# Altium schematic sheet protect.SchDoc
size A4
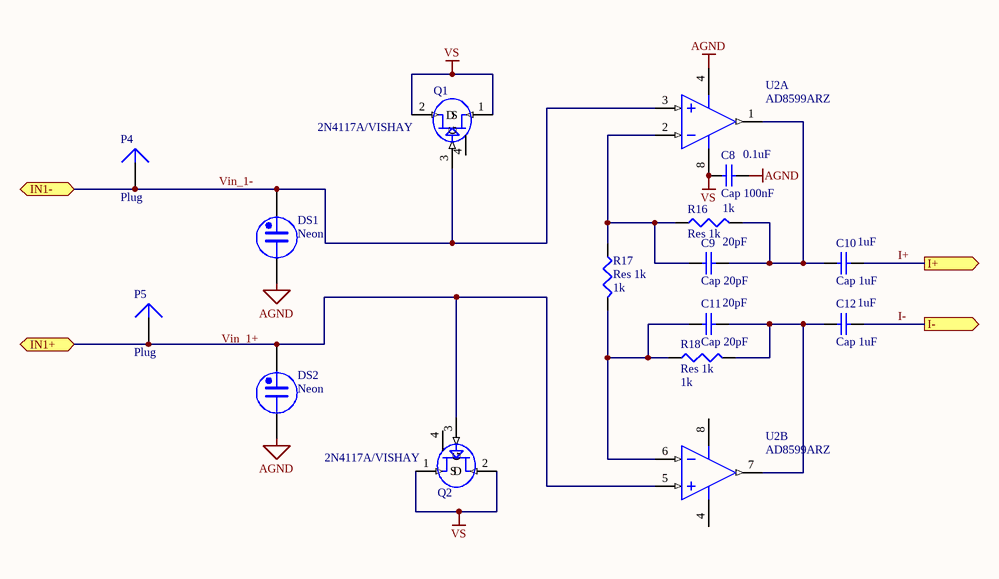
[diagram p0: protect.SchDoc]

## Parts
C8  Cap 100nF  value 0.1uF  [0402]
C9  Cap 20pF  value 20pF  [0402]
C10  Cap 1uF  value 1uF  [0402]
C11  Cap 20pF  value 20pF  [0402]
C12  Cap 1uF  value 1uF  [0402]
DS1  Neon  [PIN2]
DS2  Neon  [PIN2]
P4  Plug  [PIN1]
P5  Plug  [PIN1]
Q1  2N4117A/VISHAY  [TO236]
Q2  2N4117A/VISHAY  [TO236]
R16  Res 1k  value 1k  [0402]
R17  Res 1k  value 1k  [0402]
R18  Res 1k  value 1k  [0402]
U2  AD8599ARZ  [ADI-R-8_N]  (parts A,B of 2)

## Ports
I+ (out), I- (out), IN1+, IN1-

## Nets
AGND: C8.1 DS1.2 DS2.2 U2.4(-V)
VS: C8.2 Q1.1(S) Q1.2(D) Q2.1(S) Q2.2(D) U2.8(+V)
I+: C10.1 ; port I+
I-: C12.1 ; port I-
IN1+: DS2.1 P5.1 Q2.3(G) U2.5(+IN_B) ; port IN1+
Vin_1-: DS1.1 P4.1 Q1.3(G) U2.3(+IN_A) ; port IN1-
NetC9_1: C9.1 C10.2 R16.2 U2.1(OUT_A)
NetC9_2: C9.2 R16.1 R17.1 U2.2(-IN_A)
NetC11_1: C11.1 C12.2 R18.2 U2.7(OUT_B)
NetC11_2: C11.2 R17.2 R18.1 U2.6(-IN_B)

Not connected (* = marked no-connect by the designer): Q1 4; Q2 4

## Notes on the sheet
- Labels drawn without touching a wire or pin: Vin_1+

## Library data of the parts
C8-C12 = Cap Semi: Capacitor (Semiconductor SIM Model); Published: 8-Jun-2000; LatestRevisionDate: 29-May-2009; LatestRevisionNote: IPC-7351 Footprint Added.; PackageReference: C1206; Publisher: Altium Limited; PackageDescription: Chip Capacitor
DS1 DS2 = Neon: Neon Bulb; Published: 24-Mar-1999; LatestRevisionDate: 17-Jul-2002; LatestRevisionNote: Re-released for DXP Platform.; PackageReference: PIN2; Publisher: Altium Limited
Q1 Q2 = JFET N
R16-R18 = Res3: Resistor; Published: 8-Jun-2000; LatestRevisionDate: 29-May-2009; LatestRevisionNote: IPC-7351 Footprint Added.; PackageReference: J1-0603; Publisher: Altium Limited; PackageDescription: Chip Resistor
U2 = AD8599ARZ: Double Channel Wide Bandwidth Operational Amplifier, 10 MHz BW, 16 V/us SR, Industrial, 8-pin SOIC (R-8), Tube; Generica Part Number: AD8599; Manufacturer: Analog Devices; Amplifiers Per Package: 2; Input Bias Current: 25nA; Input Offset Voltage: 10uV; Iq/Amp: 5.7mA; Slew Rate: 14V/us; Small Signal Bandwidth: 10MHz; V Span Max: 30V; V Span Min: 9V; DatasheetVersion: Rev. C; PackageVersion: 060506-A; PackageReference: R-8; PackageDescription: 8-Pin Standard Small Outline Package, Body 3.9 x 4.9 mm, Pitch 1.27 mm; Supplier 1: Digi-Key; Supplier Part Number 1: AD8599ARZ-ND; Supplier 2: Farnell; Supplier Part Number 2: 1438872; Supplier 3: Newark; Supplier Part Number 3: 34M5072; Mounting Technology: Surface Mount; Code_JEDEC: MS-012-AA; PartNumber: AD8599ARZ; ComponentLink1Description: Manufacturer URL; ComponentLink1URL: http://www.analog.com/en/index.html; ComponentLink2Description: Datasheet; ComponentLink2URL: http://www.analog.com/static/imported-files/data_sheets/AD8597_8599.pdf; ComponentLink3Description: Package Specification; ComponentLink3URL: http://www.analog.com/static/imported-files/packages/PKG_PDF/SOIC_Narrow%20(R)/R_8.pdf; ComponentLink4Description: URL Link1; ComponentLink4URL: Reference Circuit:http://www.analog.com/en/all-operational-amplifiers-op-amps/operational-amplifiers-op-amps/ad8599/products/product.html#product-recommendations
P4 P5 = Plug: LatestRevisionDate: 17-Jul-2002; LatestRevisionNote: Re-released for DXP Platform.; Publisher: Altium Limited